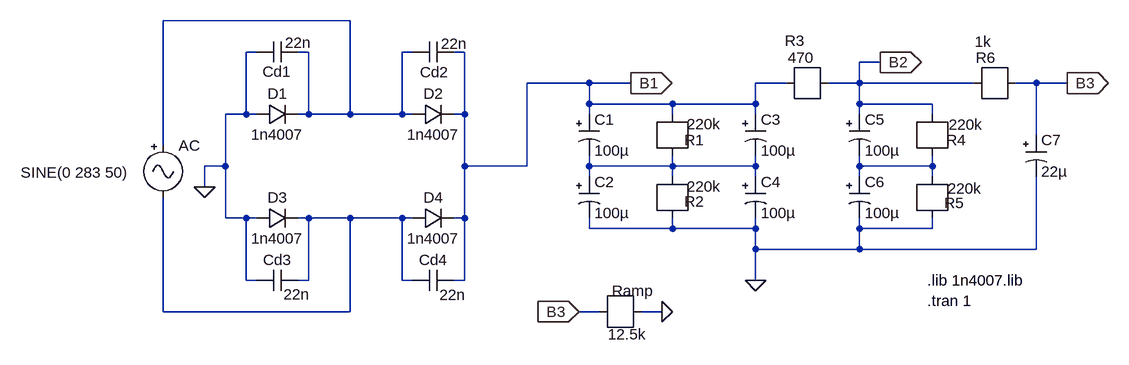
[diagram p0: schematic psu.asc]
psu.asc, the LTspice schematic file:
Version 4
SHEET 1 2708 680
WIRE 992 64 704 64
WIRE 848 112 832 112
WIRE 928 112 912 112
WIRE 1088 112 1072 112
WIRE 1168 112 1152 112
WIRE 1808 128 1776 128
WIRE 1360 160 1264 160
WIRE 1424 160 1360 160
WIRE 1664 160 1616 160
WIRE 1776 160 1776 128
WIRE 1776 160 1728 160
WIRE 1952 160 1776 160
WIRE 2048 160 2016 160
WIRE 2096 160 2048 160
WIRE 1360 192 1360 160
WIRE 1488 192 1360 192
WIRE 1616 192 1616 160
WIRE 1616 192 1488 192
WIRE 1776 192 1776 160
WIRE 1888 192 1776 192
WIRE 832 208 832 112
WIRE 832 208 800 208
WIRE 848 208 832 208
WIRE 928 208 928 112
WIRE 928 208 912 208
WIRE 992 208 992 64
WIRE 992 208 928 208
WIRE 1072 208 1072 112
WIRE 1072 208 992 208
WIRE 1088 208 1072 208
WIRE 1168 208 1168 112
WIRE 1168 208 1152 208
WIRE 1360 208 1360 192
WIRE 1488 208 1488 192
WIRE 1616 208 1616 192
WIRE 1776 208 1776 192
WIRE 1888 208 1888 192
WIRE 2048 240 2048 160
WIRE 704 256 704 64
WIRE 800 288 800 208
WIRE 800 288 768 288
WIRE 1168 288 1168 208
WIRE 1264 288 1264 160
WIRE 1264 288 1168 288
WIRE 1360 288 1360 272
WIRE 1488 288 1488 272
WIRE 1488 288 1360 288
WIRE 1616 288 1616 272
WIRE 1616 288 1488 288
WIRE 1776 288 1776 272
WIRE 1888 288 1888 272
WIRE 1888 288 1776 288
WIRE 1360 304 1360 288
WIRE 1488 304 1488 288
WIRE 1616 304 1616 288
WIRE 1776 304 1776 288
WIRE 1888 304 1888 288
WIRE 768 320 768 288
WIRE 800 368 800 288
WIRE 832 368 800 368
WIRE 848 368 832 368
WIRE 928 368 912 368
WIRE 992 368 928 368
WIRE 1072 368 992 368
WIRE 1088 368 1072 368
WIRE 1168 368 1168 288
WIRE 1168 368 1152 368
WIRE 1360 384 1360 368
WIRE 1488 384 1488 368
WIRE 1488 384 1360 384
WIRE 1616 384 1616 368
WIRE 1616 384 1488 384
WIRE 1776 384 1776 368
WIRE 1888 384 1888 368
WIRE 1888 384 1776 384
WIRE 1616 416 1616 384
WIRE 1776 416 1776 384
WIRE 1776 416 1616 416
WIRE 2048 416 2048 304
WIRE 2048 416 1776 416
WIRE 832 464 832 368
WIRE 848 464 832 464
WIRE 928 464 928 368
WIRE 928 464 912 464
WIRE 1072 464 1072 368
WIRE 1088 464 1072 464
WIRE 1168 464 1168 368
WIRE 1168 464 1152 464
WIRE 1616 464 1616 416
WIRE 704 512 704 336
WIRE 992 512 992 368
WIRE 992 512 704 512
WIRE 1376 512 1344 512
WIRE 1472 512 1440 512
FLAG 768 320 0
FLAG 1424 160 B1
IOPIN 1424 160 Out
FLAG 1616 464 0
FLAG 1808 128 B2
IOPIN 1808 128 Out
FLAG 2096 160 B3
IOPIN 2096 160 Out
FLAG 1472 512 0
FLAG 1344 512 B3
IOPIN 1344 512 In
SYMBOL diode 848 224 R270
WINDOW 0 32 32 VTop 2
WINDOW 3 0 32 VBottom 2
SYMATTR InstName D1
SYMATTR Value 1n4007
SYMBOL signal 704 240 R0
WINDOW 3 -219 58 Left 2
SYMATTR Value SINE(0 283 50)
SYMATTR InstName AC
SYMBOL diode 1088 224 R270
WINDOW 0 32 32 VTop 2
WINDOW 3 0 32 VBottom 2
SYMATTR InstName D2
SYMATTR Value 1n4007
SYMBOL diode 848 384 R270
WINDOW 0 32 32 VTop 2
WINDOW 3 0 32 VBottom 2
SYMATTR InstName D3
SYMATTR Value 1n4007
SYMBOL diode 1088 384 R270
WINDOW 0 32 32 VTop 2
WINDOW 3 0 32 VBottom 2
SYMATTR InstName D4
SYMATTR Value 1n4007
SYMBOL r 1488 208 R90
WINDOW 0 40 -49 VRight 2
WINDOW 3 15 -75 VRight 2
SYMATTR InstName R1
SYMATTR Value 220k
SYMBOL cap 1152 448 R90
WINDOW 0 0 32 VBottom 2
WINDOW 3 23 2 VTop 2
SYMATTR InstName Cd4
SYMATTR Value 22n
SYMBOL cap 1152 96 R90
WINDOW 0 63 30 VBottom 2
WINDOW 3 -12 0 VTop 2
SYMATTR InstName Cd2
SYMATTR Value 22n
SYMBOL cap 912 448 R90
WINDOW 0 0 32 VBottom 2
WINDOW 3 22 2 VTop 2
SYMATTR InstName Cd3
SYMATTR Value 22n
SYMBOL cap 912 96 R90
WINDOW 0 62 33 VBottom 2
WINDOW 3 -14 0 VTop 2
SYMATTR InstName Cd1
SYMATTR Value 22n
SYMBOL r 1488 304 R90
WINDOW 0 38 -49 VRight 2
WINDOW 3 15 -75 VRight 2
SYMATTR InstName R2
SYMATTR Value 220k
SYMBOL polcap 1344 208 R0
SYMATTR InstName C1
SYMATTR Value 100µ
SYMBOL polcap 1344 304 R0
SYMATTR InstName C2
SYMATTR Value 100µ
SYMBOL polcap 1600 208 R0
SYMATTR InstName C3
SYMATTR Value 100µ
SYMBOL polcap 1600 304 R0
SYMATTR InstName C4
SYMATTR Value 100µ
SYMBOL r 1664 160 R0
WINDOW 0 28 -65 Right 2
WINDOW 3 42 -39 Right 2
SYMATTR InstName R3
SYMATTR Value 470
SYMBOL polcap 1760 208 R0
SYMATTR InstName C5
SYMATTR Value 100µ
SYMBOL polcap 1760 304 R0
SYMATTR InstName C6
SYMATTR Value 100µ
SYMBOL r 1888 208 R90
WINDOW 0 40 -52 VRight 2
WINDOW 3 16 -78 VRight 2
SYMATTR InstName R4
SYMATTR Value 220k
SYMBOL r 1888 304 R90
WINDOW 0 41 -49 VRight 2
WINDOW 3 18 -76 VRight 2
SYMATTR InstName R5
SYMATTR Value 220k
SYMBOL r 1952 160 R0
WINDOW 0 34 -39 Right 2
WINDOW 3 27 -64 Right 2
SYMATTR InstName R6
SYMATTR Value 1k
SYMBOL polcap 2032 240 R0
SYMATTR InstName C7
SYMATTR Value 22µ
SYMBOL r 1440 512 R180
WINDOW 0 45 32 Right 2
WINDOW 3 51 -35 Right 2
SYMATTR InstName Ramp
SYMATTR Value 12.5k
TEXT 1880 464 Left 2 !.lib 1n4007.lib\n.tran 1

The netlist it stands for:
* psu.asc
D1 0 N001 1n4007
V§AC N001 N004 SINE(0 283 50)
D2 N001 B1 1n4007
D3 0 N004 1n4007
D4 N004 B1 1n4007
R1 N002 B1 220k
Cd4 B1 N004 22n
Cd2 B1 N001 22n
Cd3 N004 0 22n
Cd1 N001 0 22n
R2 0 N002 220k
C1 B1 N002 100µ
C2 N002 0 100µ
C3 B1 N002 100µ
C4 N002 0 100µ
R3 B2 B1 470
C5 B2 N003 100µ
C6 N003 0 100µ
R4 N003 B2 220k
R5 0 N003 220k
R6 B3 B2 1k
C7 B3 0 22µ
Ramp B3 0 12.5k
.model D D
.lib standard.dio
.lib 1n4007.lib
.tran 1
.backanno
.end